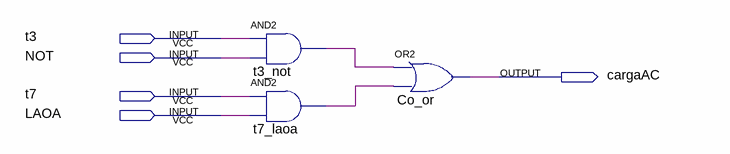
[diagram p0: schematic sheet]
// Quartus schematic carga_ac.bdf as structural Verilog: 3 symbols, 5 pins
module carga_ac (
  input  t3,
  input  NOT,
  input  t7,
  input  LAOA,
  output cargaAC
);

  wire t3_not_out, t7_laoa_out;

  and t3_not (t3_not_out, t3, NOT);
  and t7_laoa (t7_laoa_out, t7, LAOA);
  or Co_or (cargaAC, t3_not_out, t7_laoa_out);
endmodule
